# Altium schematic sheet control_block.SchDoc
size 594 x 420 mm; SheetNumber: 1; PageSetup: Record=PageOptions|CenterHorizontal=True|CenterVertical=True|PrintScale=0.94|XCorrection=1.00|YCorrection=1.00|PrintKind=1|BorderSize=5000000|LeftOffset=0|BottomOffset=0|Orientation=1|PaperLength=1000|PaperWidth=1000|Scale=100|PaperSource=7|PrintQuality=-4|MediaType=1|DitherType=10|PaperKind=A4|PrintScaleMode=1; DecimalNumber: ИУ4.11.03.03.20.07.71.23.003 Э3; HeadOfSector: Нач. сектора; Name: Наименование
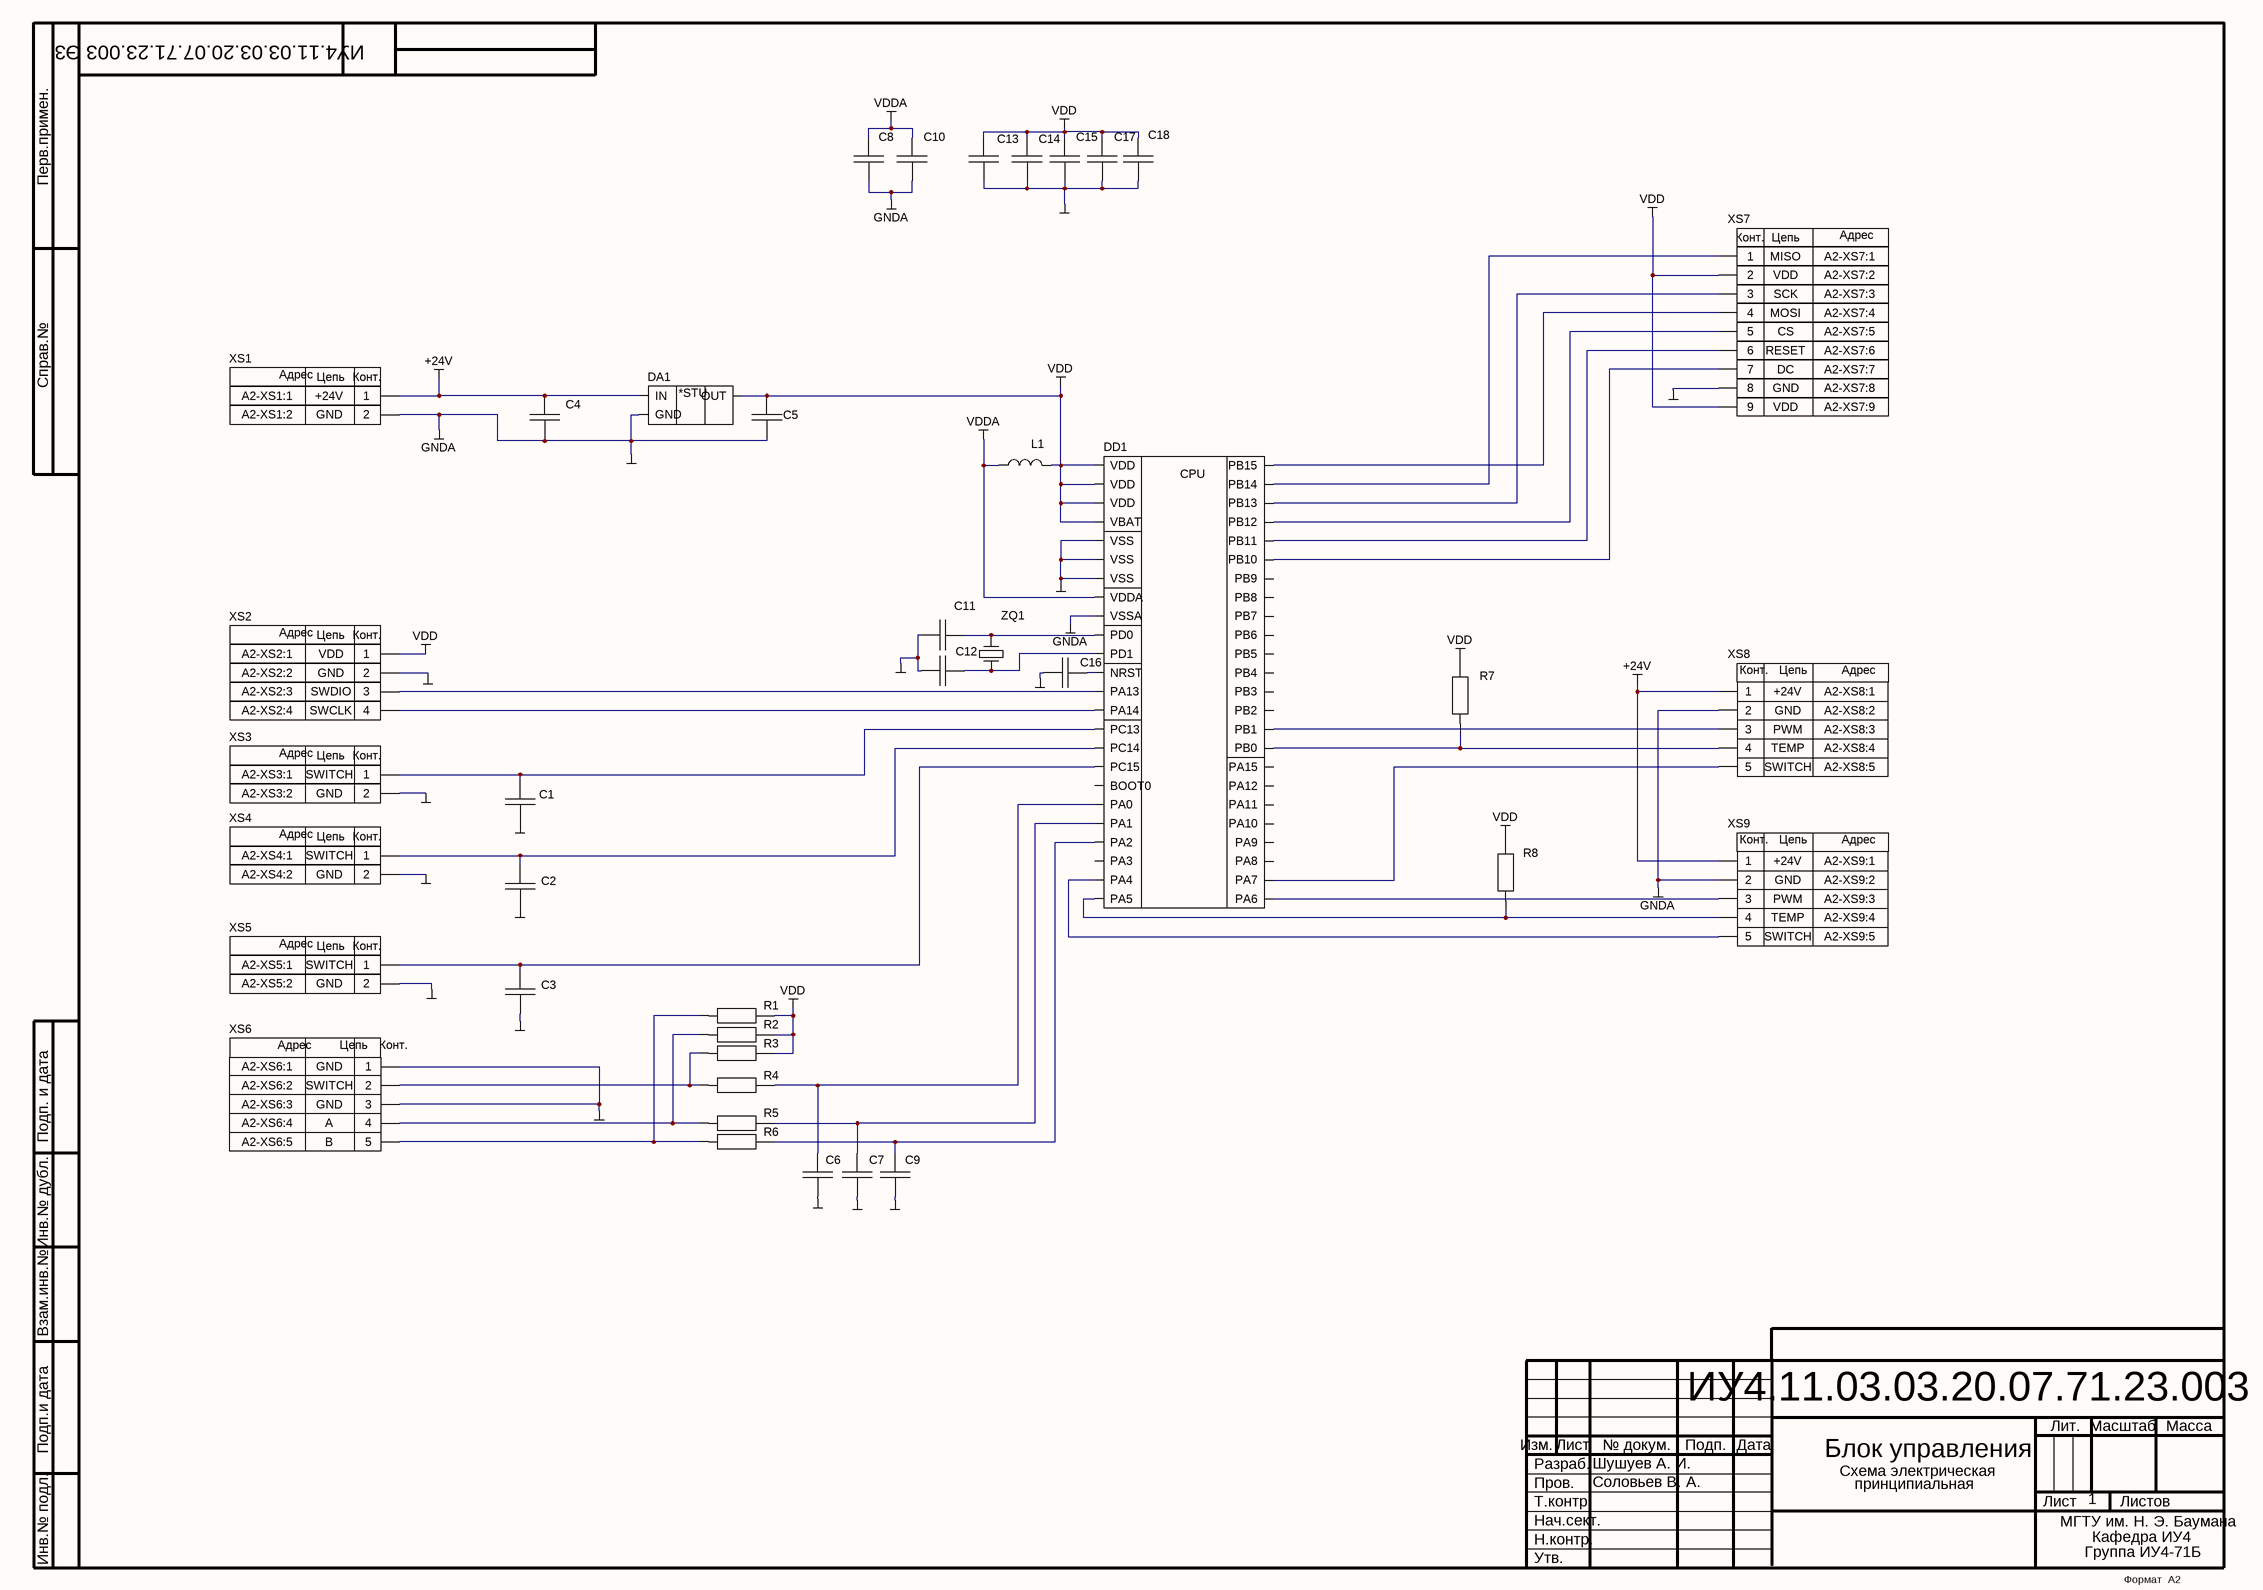
[diagram p0: control_block.SchDoc]

## Parts
C1  100 нФ  [CAP: 0603]  (value not drawn)
C2  100 нФ  [CAP: 0603]  (value not drawn)
C3  100 нФ  [CAP: 0603]  (value not drawn)
C4  0.330 мкФ  [CAP: 0603]  (value not drawn)
C5  100 нФ  [CAP: 0603]  (value not drawn)
C6  100 нФ  [CAP: 0603]  (value not drawn)
C7  100 нФ  [CAP: 0603]  (value not drawn)
C8  1 мкФ  [CAP: 0603]  (value not drawn)
C9  100 нФ  [CAP: 0603]  (value not drawn)
C10  10 нФ  [CAP: 0603]  (value not drawn)
C11  22 пФ  [CAP: 0603]  (value not drawn)
C12  22 пФ  [CAP: 0603]  (value not drawn)
C13  100 нФ  [CAP: 0603]  (value not drawn)
C14  100 нФ  [CAP: 0603]  (value not drawn)
C15  100 нФ  [CAP: 0603]  (value not drawn)
C16  100 нФ  [CAP: 0603]  (value not drawn)
C17  100 нФ  [CAP: 0603]  (value not drawn)
C18  4.7 мкФ  [CAP: 0603]  (value not drawn)
DA1  78xx  [SOT89]  (value not drawn)
DD1  STM32F103C8T6  (value not drawn)
L1  10 мкГн  [IND: 0805]  (value not drawn)
R1  Res  [RES: 0603]  (value not drawn)
R2  Res  [RES: 0603]  (value not drawn)
R3  Res  [RES: 0603]  (value not drawn)
R4  Res  [RES: 0603]  (value not drawn)
R5  Res  [RES: 0603]  (value not drawn)
R6  Res  [RES: 0603]  (value not drawn)
R7  Res  [RES: 1206]  (value not drawn)
R8  Res  [RES: 1206]  (value not drawn)
XS1  circuit2: GND  circuit1: +24V  =address2: A2-XS1:2  =address1: A2-XS1:1  [CON: WF-02]  (hidden comment: X2)
XS2  circuit2: GND  circuit3: SWDIO  circuit1: VDD  circuit4: SWCLK  =address4: A2-XS2:4  =address3: A2-XS2:3  =address2: A2-XS2:2  =address1: A2-XS2:1  [CON: WF-04]  (hidden comment: X4)
XS3  circuit2: GND  circuit1: SWITCH  =address2: A2-XS3:2  =address1: A2-XS3:1  [CON: WF-02]  (hidden comment: X2)
XS4  circuit2: GND  circuit1: SWITCH  =address2: A2-XS4:2  =address1: A2-XS4:1  [CON: WF-02]  (hidden comment: X2)
XS5  circuit2: GND  circuit1: SWITCH  =address2: A2-XS5:2  =address1: A2-XS5:1  [CON: WF-02]  (hidden comment: X2)
XS6  cirtuit5: B  circuit4: A  circuit3: GND  circuit2: SWITCH  =address5: A2-XS6:5  =address4: A2-XS6:4  =address3: A2-XS6:3  =address2: A2-XS6:2  =address1: A2-XS6:1  [CON: CWF-5]  (hidden comment: X5)
XS7  circtuit9: VDD  circtuit8: GND  circtuit7: DC  circtuit6: RESET  circtuit5: CS  circtuit4: MOSI  circtuit3: SCK  circtuit1: MISO  =address9: A2-XS7:9  =address8: A2-XS7:8  =address7: A2-XS7:7  =address5: A2-XS7:5  =address6: A2-XS7:6  =address4: A2-XS7:4  =address3: A2-XS7:3  =address2: A2-XS7:2  =address1: A2-XS7:1  [CON: IDC-10MS]  (hidden comment: X9)
XS8  cirtuit5: SWITCH  circuit4: TEMP  circuit3: PWM  circuit2: GND  circuit1: +24V  =address5: A2-XS8:5  =address4: A2-XS8:4  =address3: A2-XS8:3  =address2: A2-XS8:2  =address1: A2-XS8:1  [CON: CWF-5]  (hidden comment: X5)
XS9  cirtuit5: SWITCH  circuit4: TEMP  circuit3: PWM  circuit2: GND  circuit1: +24V  =address5: A2-XS9:5  =address4: A2-XS9:4  =address3: A2-XS9:3  =address2: A2-XS9:2  =address1: A2-XS9:1  [CON: CWF-5]  (hidden comment: X5)
ZQ1  AT-41CD2-8MHz  [AT-41CD2]  (value not drawn)

## Nets
+24V: C4.2 DA1.1(IN) XS1.1 XS8.1 XS9.1
GND: C1.1 C2.1 C3.1 C4.1 C5.1 C6.1 C7.1 C8.1 C9.1 C10.1 C11.1 C12.1 C13.1 C14.1 C15.1 C16.1 C17.1 C18.1 DA1.3(GND) DD1.8(VSSA) DD1.23(VSS) DD1.35(VSS) DD1.47(VSS) XS1.2 XS2.2 XS3.2 XS4.2 XS5.2 XS6.1 XS6.3 XS7.8 XS8.2 XS9.2  [also labelled GNDA]
VDD: C5.2 C13.2 C14.2 C15.2 C17.2 C18.2 DA1.2(OUT) DD1.1(VBAT) DD1.24(VDD) DD1.36(VDD) DD1.48(VDD) L1.2 R1.2 R2.2 R3.2 R7.2 R8.2 XS2.1 XS7.2 XS7.9
VDDA: C8.2 C10.2 DD1.9(VDDA) L1.1
NetC1_2: C1.2 DD1.2(PC13) XS3.1
NetC2_2: C2.2 DD1.3(PC14) XS4.1
NetC3_2: C3.2 DD1.4(PC15) XS5.1
NetC6_2: C6.2 DD1.10(PA0) R4.2
NetC7_2: C7.2 DD1.11(PA1) R5.2
NetC9_2: C9.2 DD1.12(PA2) R6.2
NetC11_2: C11.2 DD1.5(PD0) ZQ1.2
NetC12_2: C12.2 DD1.6(PD1) ZQ1.1
NetC16_2: C16.2 DD1.7(NRST)
NetDD1_14: DD1.14(PA4) XS9.5
NetDD1_15: DD1.15(PA5) R8.1 XS9.4
NetDD1_16: DD1.16(PA6) XS9.3
NetDD1_17: DD1.17(PA7) XS8.5
NetDD1_18: DD1.18(PB0) R7.1 XS8.4
NetDD1_19: DD1.19(PB1) XS8.3
NetDD1_21: DD1.21(PB10) XS7.7
NetDD1_22: DD1.22(PB11) XS7.6
NetDD1_25: DD1.25(PB12) XS7.5
NetDD1_26: DD1.26(PB13) XS7.3
NetDD1_27: DD1.27(PB14) XS7.1
NetDD1_28: DD1.28(PB15) XS7.4
NetDD1_34: DD1.34(PA13) XS2.3
NetDD1_37: DD1.37(PA14) XS2.4
NetR1_1: R1.1 R6.1 XS6.5
NetR2_1: R2.1 R5.1 XS6.4
NetR3_1: R3.1 R4.1 XS6.2

Not connected (* = marked no-connect by the designer): DD1 13(PA3) 20(PB2) 29(PA8) 30(PA9) 31(PA10) 32(PA11) 33(PA12) 38(PA15) 39(PB3) 40(PB4) 41(PB5) 42(PB6) 43(PB7) 44(BOOT0) 45(PB8) 46(PB9)

## Notes on the sheet
- Блок управления
- Шушуев А. И.
- Соловьев В. А.
- Схема электрическая
- принципиальная
- МГТУ им. Н. Э. Баумана
- Группа ИУ4-71Б
- Кафедра ИУ4
- Перв.примен.
- Справ.№
- Подп. и дата
- Инв.№ дубл.
- Взам.инв.№
- Подп.и дата
- Разраб.
- Изм.
- Лист
- № докум.
- Подп.
- Дата
- Лит.
- Масштаб
- Масса
- Т.контр.
- Пров.
- Листов
- Инв.№ подл.
- Утв.
- Н.контр.
- Нач.сект.
- Формат  A2
- (in symbol 78xx) *STU
- (in symbol STM32F103C8T6) CPU
- (in symbol X2) Цепь; Конт.; Адрес
- (in symbol X4) Цепь; Конт.; Адрес
- (in symbol X5) Адрес; Цепь; Конт.
- (in symbol X9) Конт.; Цепь; Адрес

## Library data of the parts
C1-C18 = C_const
DA1 = 78xx: pin to pad: 1>3 2>1 3>2
L1 = L
ZQ1 = ZQ
XS6 XS8 XS9 = X5
  XS6: circuit1: GND
XS7 = X9: circtuit2: VDD